# Altium schematic sheet BlockDiagram.SchDoc
size A3; SheetNumber: 2; SheetTotal: 3
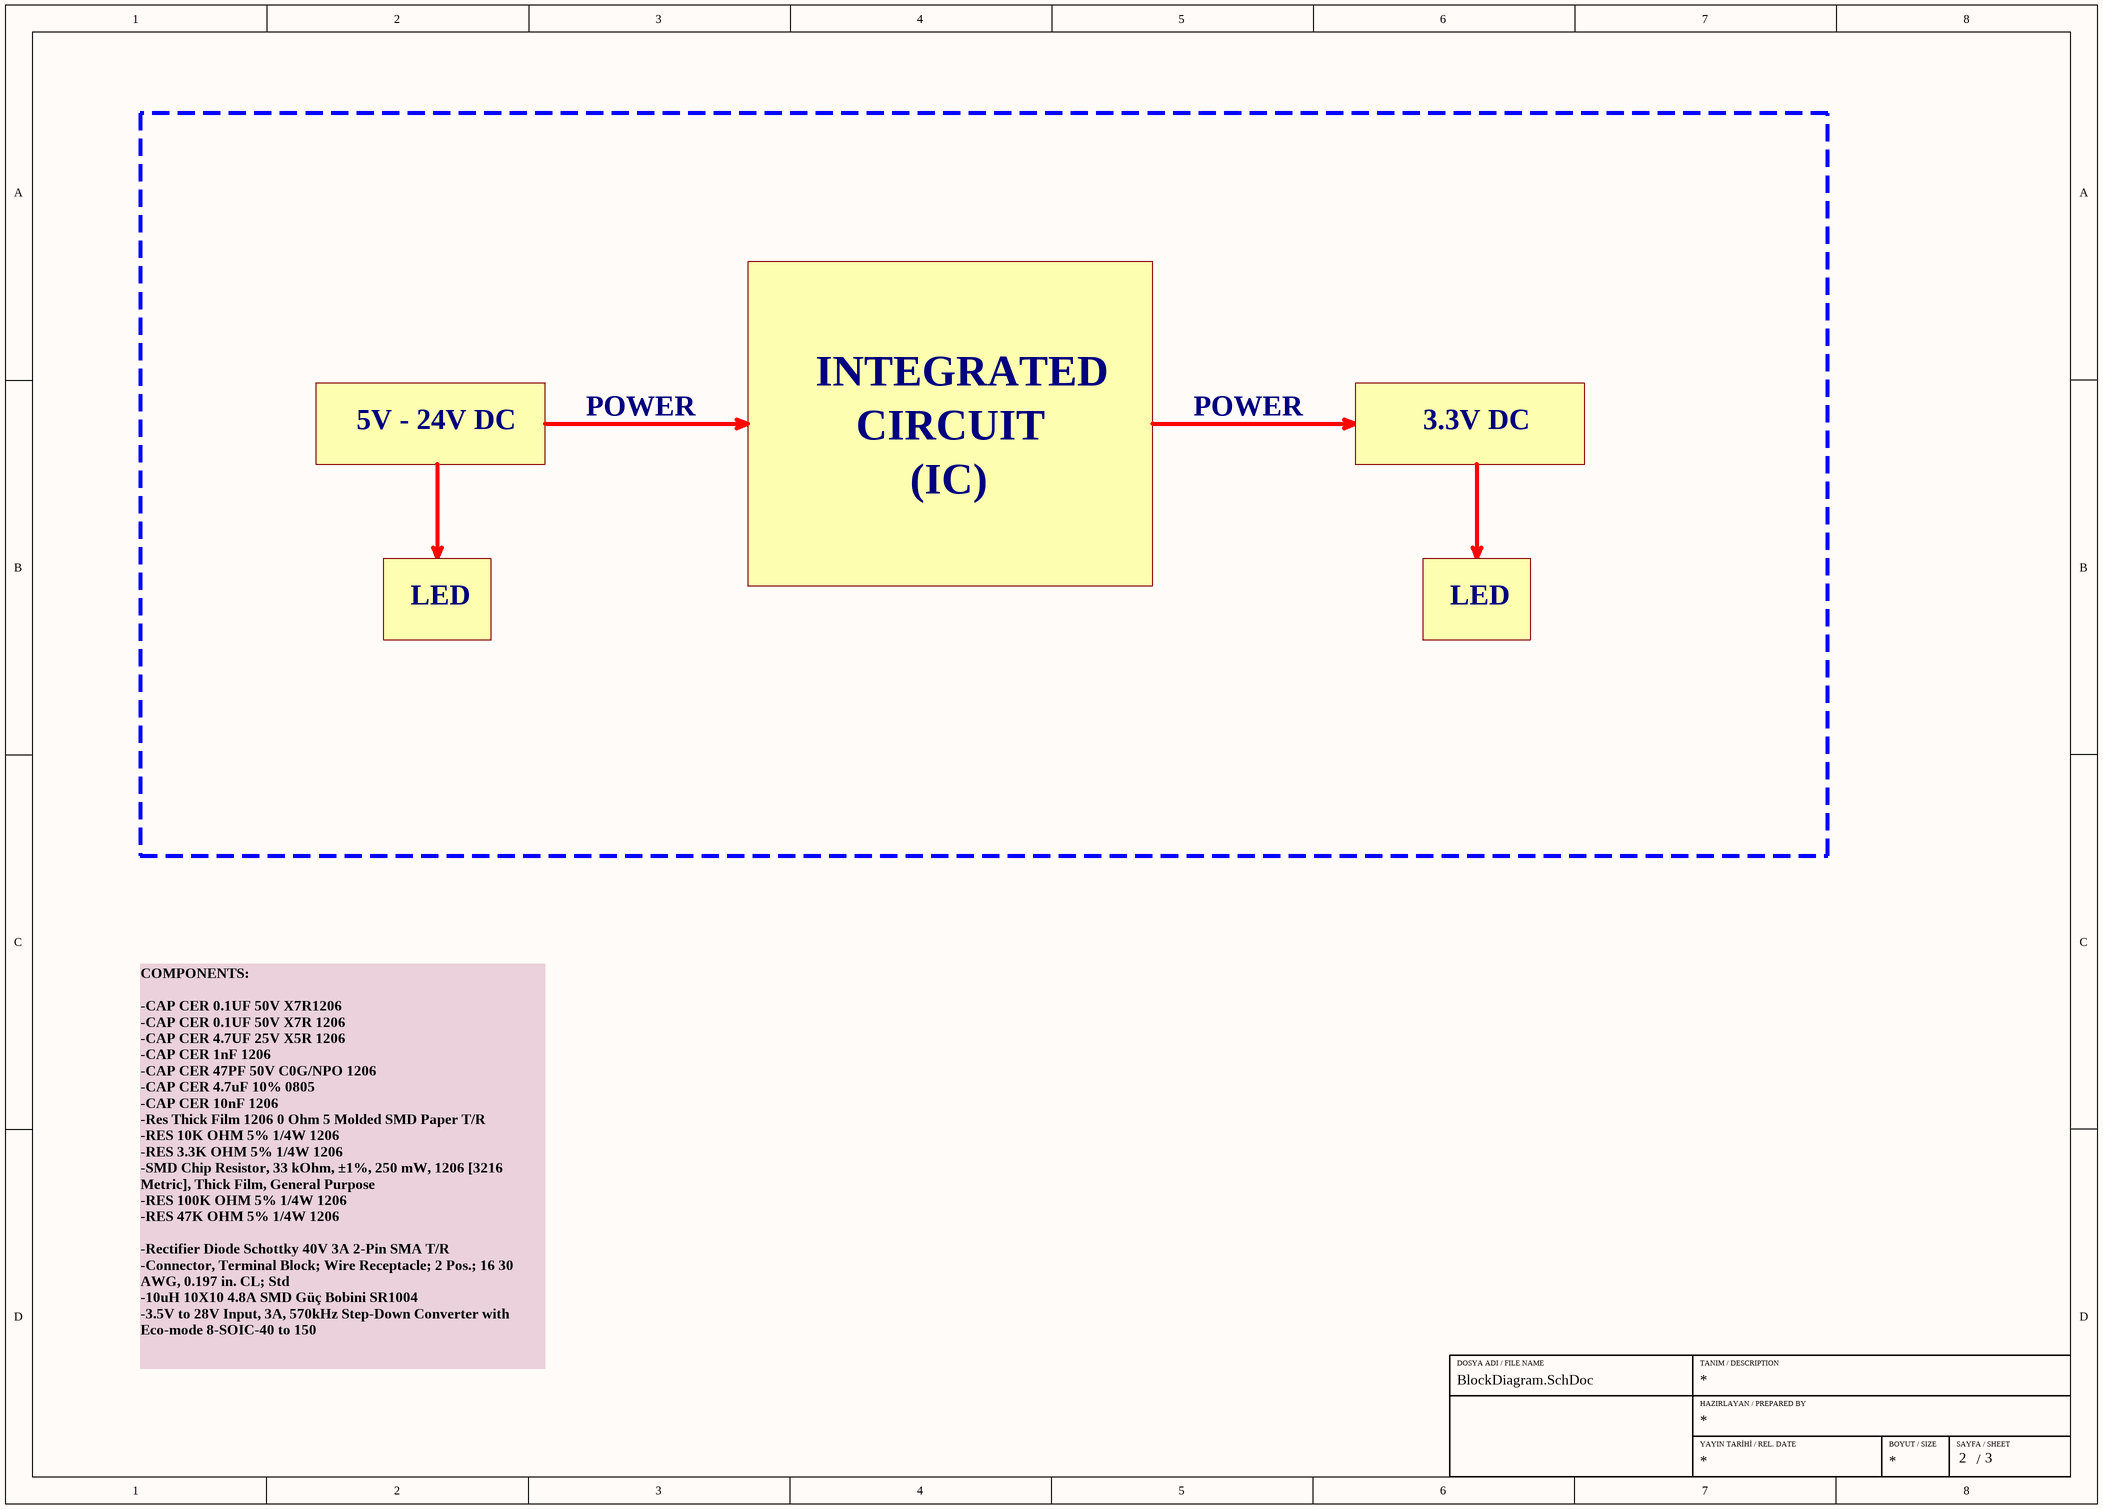
[diagram p0: BlockDiagram.SchDoc]

## Notes on the sheet
- 5V - 24V DC
- POWER
- INTEGRATED
- CIRCUIT
- 3.3V DC
- (IC)
- LED
- COMPONENTS:
  -CAP CER 0.1UF 50V X7R1206
  -CAP CER 0.1UF 50V X7R 1206
  -CAP CER 4.7UF 25V X5R 1206
  -CAP CER 1nF 1206
  -CAP CER 47PF 50V C0G/NPO 1206
  -CAP CER 4.7uF 10% 0805
  -CAP CER 10nF 1206
  -Res Thick Film 1206 0 Ohm 5 Molded SMD Paper T/R
  -RES 10K OHM 5% 1/4W 1206
  -RES 3.3K OHM 5% 1/4W 1206
  -SMD Chip Resistor, 33 kOhm, ±1%, 250 mW, 1206 [3216 Metric], Thick Film, General Purpose
  -RES 100K OHM 5% 1/4W 1206
  -RES 47K OHM 5% 1/4W 1206
  -Rectifier Diode Schottky 40V 3A 2-Pin SMA T/R
  -Connector, Terminal Block; Wire Receptacle; 2 Pos.; 16 30 AWG, 0.197 in. CL; Std
  -10uH 10X10 4.8A SMD Güç Bobini SR1004
  -3.5V to 28V Input, 3A, 570kHz Step-Down Converter with Eco-mode 8-SOIC-40 to 150
- DOSYA ADI / FILE NAME
- TANIM / DESCRIPTION
- HAZIRLAYAN / PREPARED BY
- YAYIN TARİHİ / REL. DATE
- BOYUT / SIZE
- SAYFA / SHEET
- /